# Altium schematic sheet No_Transistor_LED.SchDoc: LED
size 203 x 127 mm; DrawnBy: Kace Chandler; DocumentNumber: 16; SheetNumber: 16; SheetTotal: 23
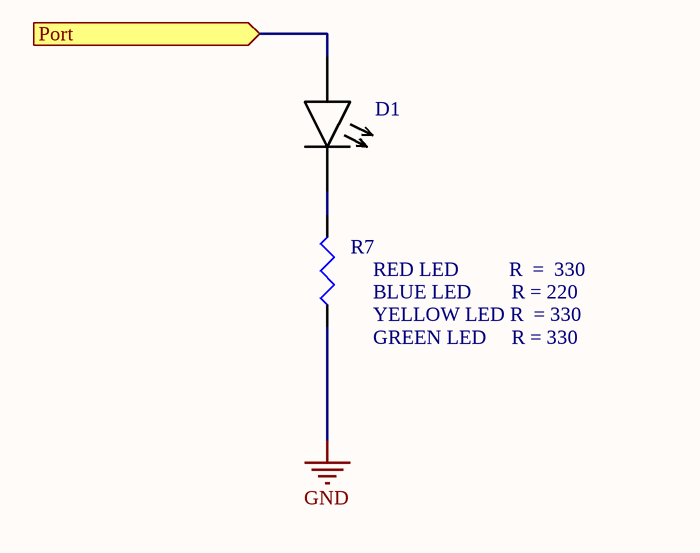
[diagram p0: No_Transistor_LED.SchDoc]

## Parts
D1  LED_R  [0402 footprint]  (value not drawn)
R7  Res3  (value not drawn)

## Ports
Port (in)

## Nets
GND: R7.1
Port: D1.1 ; port Port
NetD1_2: D1.2 R7.2

## Notes on the sheet
- (near R7) RED LED          R  =  330
- (near R7) BLUE LED        R = 220
- (near R7) YELLOW LED R  = 330
- (near R7) GREEN LED     R = 330

## Library data of the parts
R7 = Res3: Resistor; Value: Depends on the color of the LED; Published: 8-Jun-2000; LatestRevisionDate: 29-May-2009; LatestRevisionNote: IPC-7351 Footprint Added.; PackageReference: J1-0603; Publisher: Altium Limited; PackageDescription: Chip Resistor
D1 = LED_R: Supplier 1: Digi-Key; Supplier Part Number 1: 754-2123-1-ND